# EasyEDA Pro project corialis_breakout.epro

# Schematic DB
Board Name: Board1; Create Date: 2026-05-29; Page Name: P1; Project Name: corialis_breakout; Schematic Name: DB; Update Date: 2026-05-30; Company: EasyEDA.com; Page Size: A4; Version: V1.0
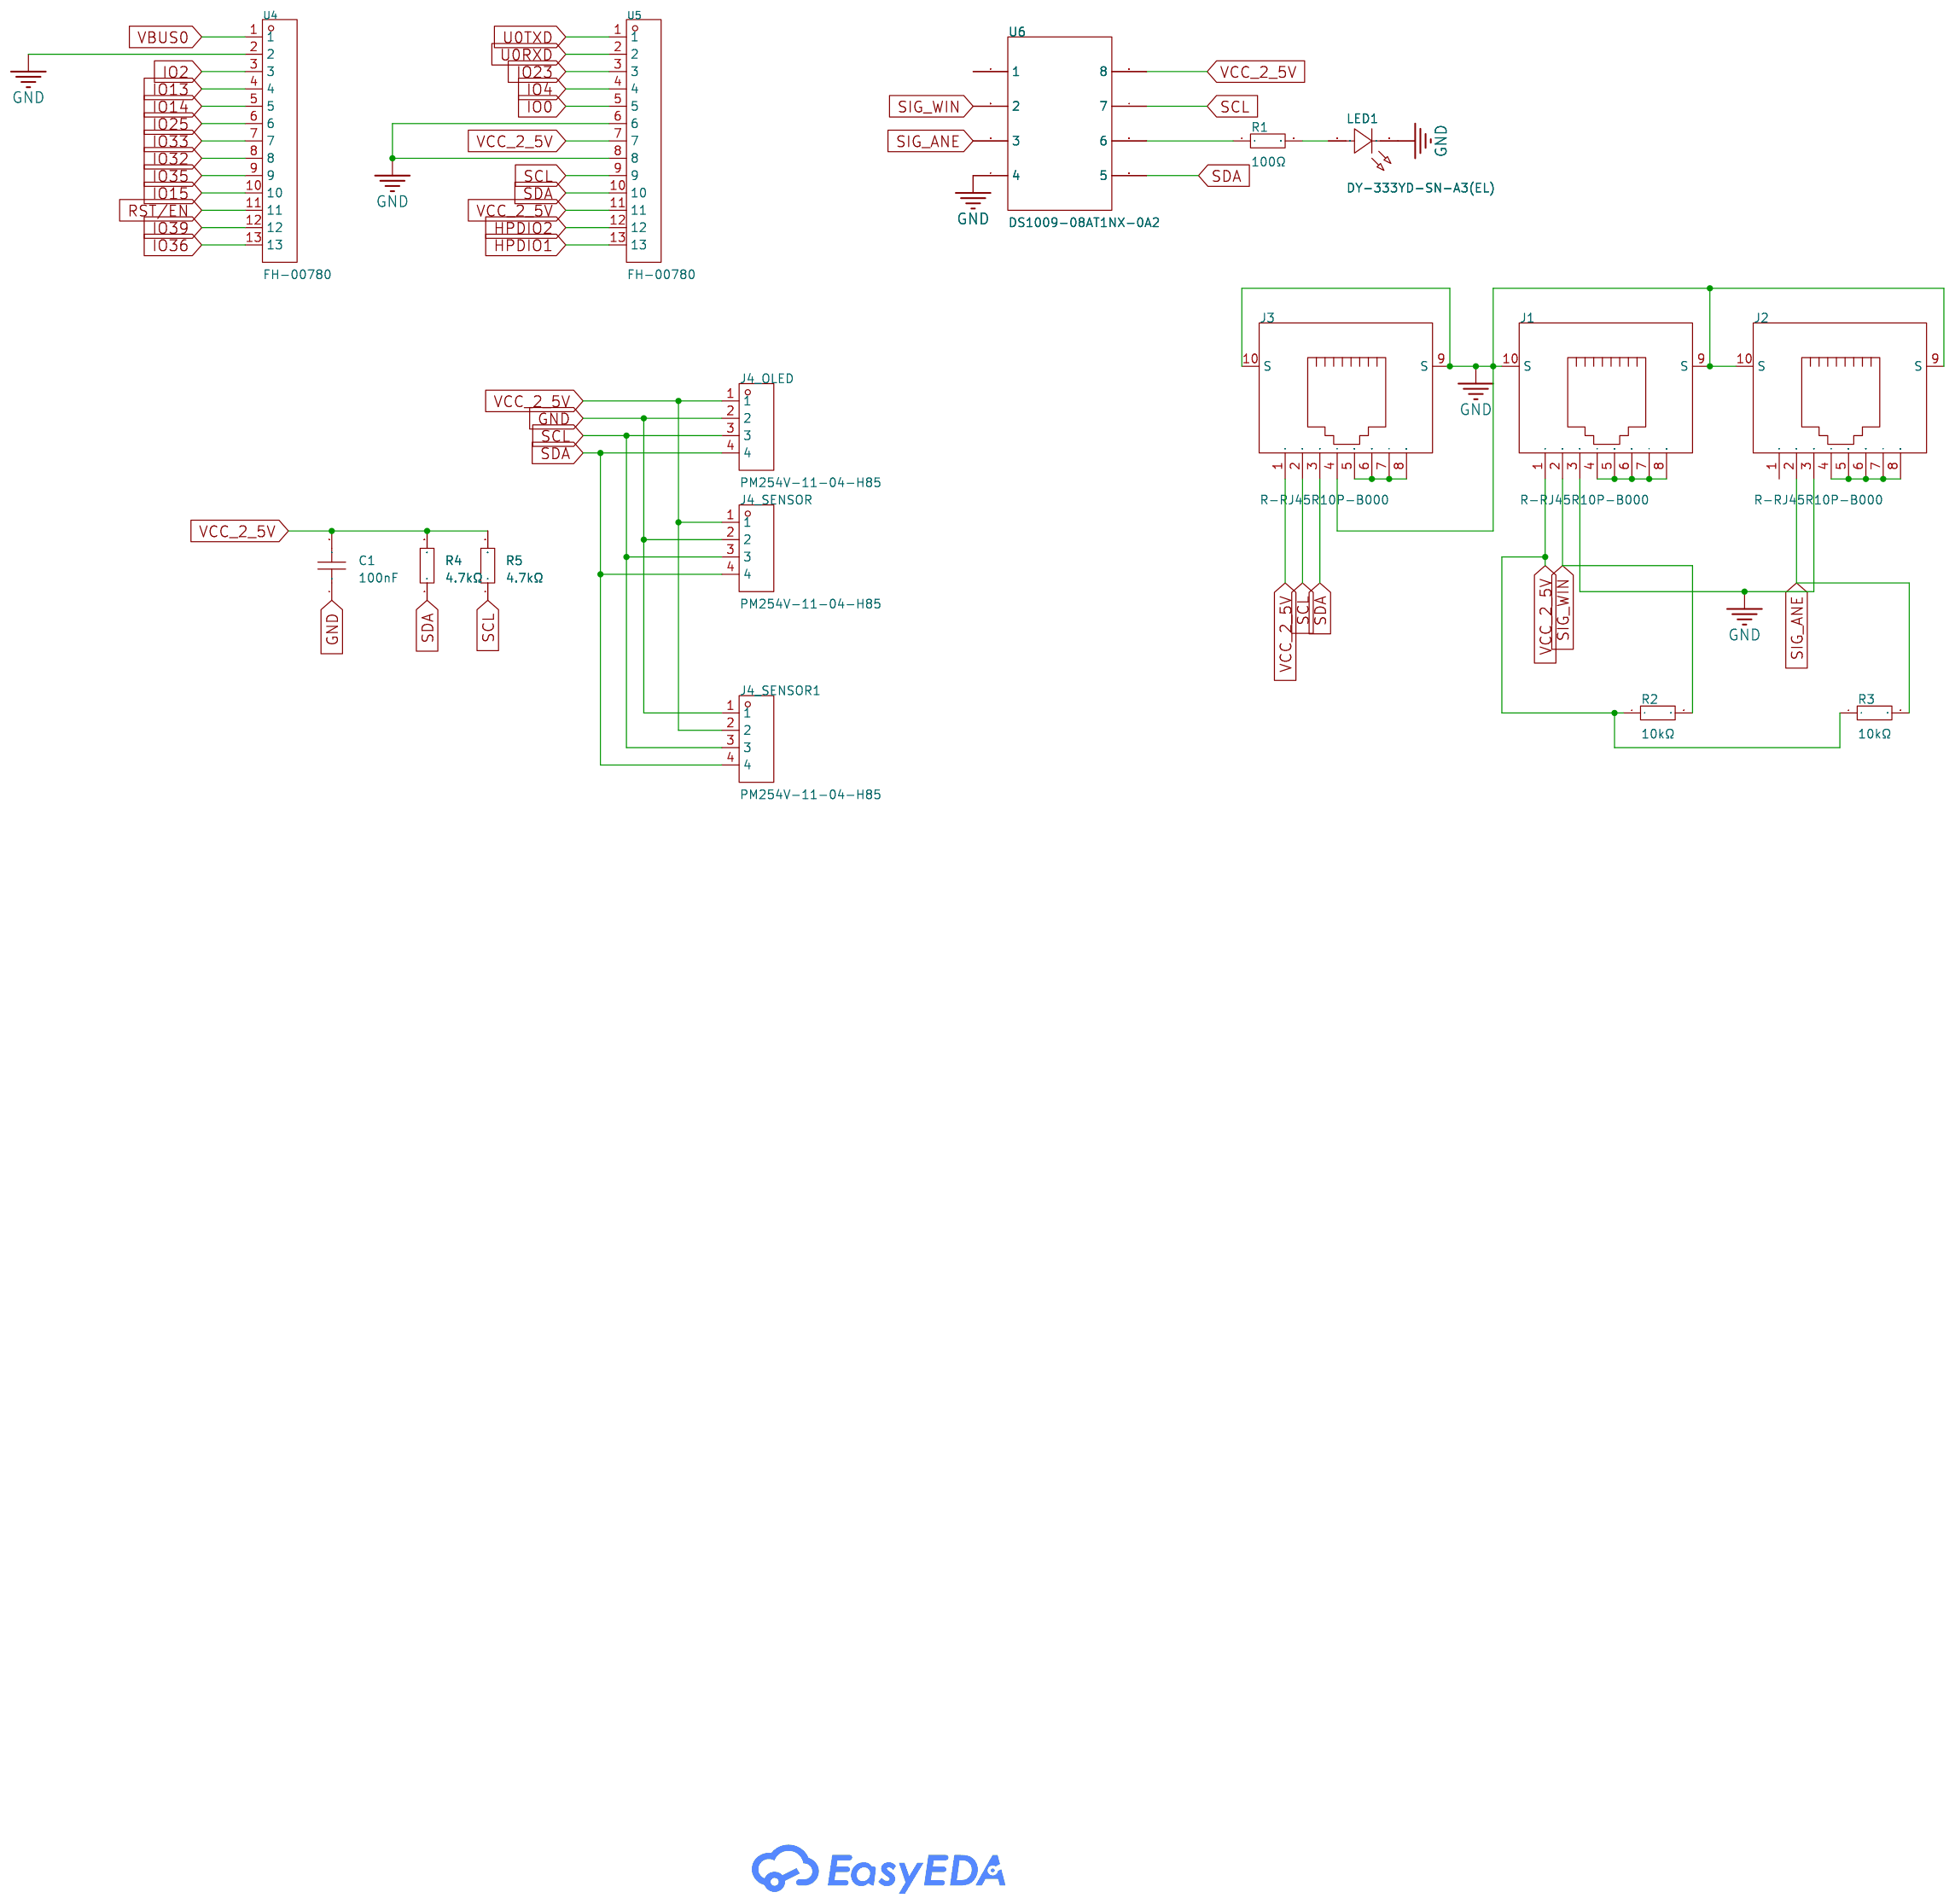
[diagram p0: schematic sheet]

## Parts
C1  100nF  [CAP-TH_L5.8-W2.4-P2.54-D0.6]
J1  R-RJ45R10P-B000  [RJ45-TH_R-RJ45R10P-B000]
J2  R-RJ45R10P-B000  [RJ45-TH_R-RJ45R10P-B000]
J3  R-RJ45R10P-B000  [RJ45-TH_R-RJ45R10P-B000]
J4_OLED  PM254V-11-04-H85  [HDR-TH_4P-P2.54-V-F]
J4_SENSOR  PM254V-11-04-H85  [HDR-TH_4P-P2.54-V-F]
J4_SENSOR1  PM254V-11-04-H85  [HDR-TH_4P-P2.54-V-F]
LED1  DY-333YD-SN-A3(EL)  [LED-TH_BD5.0-P2.54-FD-1]
R1  100Ω  [RES-TH_BD2.4-L6.3-P10.30-D0.6]
R2  10kΩ  [RES-TH_BD2.4-L6.3-P10.30-D0.6]
R3  10kΩ  [RES-TH_BD2.4-L6.3-P10.30-D0.6]
R4  4.7kΩ  [RES-TH_BD2.2-L6.5-P10.50-D0.6]
R5  4.7kΩ  [RES-TH_BD2.2-L6.5-P10.50-D0.6]
U4  FH-00780  [HDR-TH_13P-P2.54-V-F]
U5  FH-00780  [HDR-TH_13P-P2.54-V-F]
U6  DS1009-08AT1NX-0A2  [DIP-8_L10.2-W10.2-P2.54-LS7.6-BL]

## Library data of the parts
C1 = CC1H104ZA1ED3F5P1100: Capacitance:100nF Tolerance:-20%~+80% Tolerance:-20%~+80% Voltage Rating:50V Pin Spacing:2.54mm Temperature Coefficient:Y5V Diameter:5.8mm Body Thickness:2.4mm; LCSC Part Name: 100nF -20%~+80% 50V; Supplier Part: C2832506; Manufacturer: Dersonic(德尔创); Supplier Footprint: 插件,P=2.54mm; JLCPCB Part Class: Extended Part; Datasheet: https://item.szlcsc.com/datasheet/CC1H104ZA1ED3F5P1100/2990644.html; Supplier: LCSC; Tolerance: -20%~+80%; Voltage Rating: 50V; Pin Spacing: 2.54mm; Temperature Coefficient: Y5V; Diameter: 5.8mm; Body Thickness: 2.4mm; Check: true
J1-J3 = R-RJ45R10P-B000: Connector Type:RJ45 Jack Mounting Type:Right Angle Number of Ports:1 LED:Non-LED Shielding:Shielded Ratings:- Supplementary Features:Harpoon Contact (Plastic) Contact Material:Phosphor Bronze Contact Plating:Gold Operating Temperature:0℃~+70℃ Operating Te; LCSC Part Name: 弯插 不带LED; Supplier Part: C386758; Manufacturer: Ckmtw(灿科盟); Supplier Footprint: 弯插; JLCPCB Part Class: Extended Part; Datasheet: https://item.szlcsc.com/datasheet/R-RJ45R10P-B000/360865.html; Supplier: LCSC; Connector Type: RJ45 Jack; Mounting Type: Right Angle; Number of Ports: 1; LED: Non-LED; Shielding: Shielded; Supplementary Features: Harpoon Contact (Plastic); Contact Material: Phosphor Bronze; Contact Plating: Gold; Operating Temperature: 0℃~+70℃; Check: true
J4_OLED J4_SENSOR J4_SENSOR1 = PM254V-11-04-H85: Holes Structure:1x4P Pitch:2.54mm Row Spacing:- Circular Hole / Square Hole:Square Hole Mounting Type:Through Hole Number of Rows:1 Number of Positions:4P Current Rating:3A Holes Direction:Top Insulation Height:8.5mm Contact Material:Brass Contact Plating; LCSC Part Name: 1x4P 间距:2.54mm 直插; Supplier Part: C541851; Manufacturer: XFCN(兴飞); Supplier Footprint: 插件,P=2.54mm; JLCPCB Part Class: Extended Part; Datasheet: https://item.szlcsc.com/datasheet/PM254V-11-04-H85/562472.html; Supplier: LCSC; Holes Structure: 1x4P; Pitch: 2.54mm; Circular Hole / Square Hole: Square Hole; Mounting Type: Through Hole; Number of Rows: 1; Number of Positions: 4P; Current Rating: 3A; Holes Direction: Top; Insulation Height: 8.5mm; Contact Material: Brass; Operating Temperature: -40℃~+105℃; Check: true
LED1 = DY-333YD-SN-A3(EL): Lamp Holder Type:5mm round lamp head Illumination Color:Yellow Voltage - Forward(Vf):2.4V Voltage - Forward(Vf):2.4V Power(Watts):60mW Forward Current:20mA Wavelength - Dominant:592nm Wavelength - Dominant:592nm Peak Wavelength:584nm Diode Configuration:D; LCSC Part Name: 发光二极管; Supplier Part: C7470706; Manufacturer: TONYU(东裕); Supplier Footprint: D=5mm; JLCPCB Part Class: Extended Part; Datasheet: https://item.szlcsc.com/datasheet/DY-333YD-SN-A3(EL)/8521722.html; Supplier: LCSC; Lamp Holder Type: 5mm round lamp head; Illumination Color: Yellow; Voltage - Forward(Vf): 2.4V; Power(Watts): 60mW; Forward Current: 20mA; Wavelength - Dominant: 592nm; Peak Wavelength: 584nm; Diode Configuration: Discrete Diode; Lens Color: Frosted Yellow Lens; Luminous Intensity: 300mcd; Viewing Angle: 100°; Operating Temperature: -25℃~+80℃; Check: true
R1 = MFR50SJT-52-100R: Type:Metal Film Resistors Resistance: Tolerance:±5% Tolerance:±5% Power(Watts):500mW Operating Temperature:-55℃~+155℃ Operating Temperature:-55℃~+155℃; LCSC Part Name: 金属膜电阻 100Ω ±5% 500mW 铜脚，圆柱状直插; Supplier Part: C176622; Manufacturer: YAGEO(国巨); Supplier Footprint: 插件,D2.4xL6.3mm; JLCPCB Part Class: Extended Part; Datasheet: https://atta.szlcsc.com/upload/public/pdf/source/20191118/C457825_18355E864DE4965678DC27B0EBC3E21E.pdf; Supplier: LCSC; Type: Metal Film Resistors; Tolerance: ±5%; Power(Watts): 500mW; Operating Temperature: -55℃~+155℃; Check: true
R2 R3 = MFR50SJT-52-10K: Type:Metal Film Resistor Resistance:10kΩ Tolerance:±5% Tolerance:±5% Voltage-Supply(Max):- Power(Watts):500mW Operating Temperature:-55℃~+155℃ Operating Temperature:-55℃~+155℃; LCSC Part Name: 金属膜电阻 10kΩ ±5% 500mW 小体积，铜脚，圆柱状直插; Supplier Part: C176623; Manufacturer: YAGEO(国巨); Supplier Footprint: 插件,D2.4xL6.3mm; JLCPCB Part Class: Extended Part; Datasheet: https://item.szlcsc.com/datasheet/MFR50SJT-52-10K/188013.html; Supplier: LCSC; Type: Metal Film Resistor; Tolerance: ±5%; Power(Watts): 500mW; Operating Temperature: -55℃~+155℃; Check: true
R4 R5 = MFR50SJT-52-4K7: Type:Metal Film Resistors Resistance: Tolerance:±5% Tolerance:±5% Power(Watts):500mW Operating Temperature:-55℃~+155℃ Operating Temperature:-55℃~+155℃; LCSC Part Name: 金属膜电阻 4.7kΩ ±5% 500mW 小体积，铜脚，圆柱状直插; Supplier Part: C176641; Manufacturer: YAGEO(国巨); Supplier Footprint: 插件,D2.4xL6.3mm; JLCPCB Part Class: Extended Part; Datasheet: https://atta.szlcsc.com/upload/public/pdf/source/20191118/C457825_18355E864DE4965678DC27B0EBC3E21E.pdf; Supplier: LCSC; Type: Metal Film Resistors; Tolerance: ±5%; Power(Watts): 500mW; Operating Temperature: -55℃~+155℃; Check: true
U4 U5 = FH-00780: Holes Structure:1x13P Pitch:2.54mm Row Spacing:- Circular Hole / Square Hole:Square Holes Mounting Type:Straight Number of Rows:Plugin Number of Holes:13P Current Rating (Max):3A Voltage Rating (Max):- Holes Direction:Top Insulation Height:8.5mm Operating; LCSC Part Name: 间距:2.54mm 1x13P 直插; Supplier Part: C2685211; Manufacturer: Liansheng(连盛); Supplier Footprint: 插件,P=2.54mm; JLCPCB Part Class: Extended Part; Datasheet: https://atta.szlcsc.com/upload/public/pdf/source/20210126/C2685211_8FBC64DBE0F9C18E412CD3F3A5CDC87D.pdf; Supplier: LCSC; Holes Structure: 1x13P; Pitch: 2.54mm; Circular Hole / Square Hole: Square Holes; Mounting Type: Straight; Number of Rows: Plugin; Number of Holes: 13P; Current Rating (Max): 3A; Holes Direction: Top; Insulation Height: 8.5mm; Operating Temperature Range: -40℃~+105℃; Check: true
U6 = DS1009-08AT1NX-0A2: Adaptation Package Type:DIP Pitch:2.54mm Row Spacing:7.62mm Circular Holes/Square Holes:Square Hole Number of Positions:8P Contact Plating:Tin Operating Temperature:-20℃~+105℃ Operating Temperature:-20℃~+105℃; LCSC Part Name: 间距2.54mm 方孔 P数:8P; Supplier Part: C72124; Manufacturer: CONNFLY; Supplier Footprint: DIP-8; JLCPCB Part Class: Extended Part; Datasheet: https://item.szlcsc.com/datasheet/DS1009-08AT1NX-0A2/73233.html; Supplier: LCSC; Adaptation Package Type: DIP; Pitch: 2.54mm; Row Spacing: 7.62mm; Circular Holes/Square Holes: Square Hole; Number of Positions: 8P; Contact Plating: Tin; Operating Temperature: -20℃~+105℃; Check: true

## Nets
GND: C1.1 J1.3 J1.9(S) J1.10(S) J2.3 J2.9(S) J2.10(S) J3.4 J3.9(S) J3.10(S) J4_OLED.2 J4_SENSOR.2 J4_SENSOR1.1 LED1.1(K) U4.2 U5.6 U5.8 U6.4
VBUS0: U4.1
VCC_2_5V: C1.2 J1.1 J3.1 J4_OLED.1 J4_SENSOR.1 J4_SENSOR1.2 R2.1 R3.1 R4.2 R5.2 U5.7 U5.11 U6.8
HPDIO1: U5.13
HPDIO2: U5.12
IO0: U5.5
IO2: U4.3
IO4: U5.4
IO13: U4.4
IO14: U4.5
IO15: U4.10
IO23: U5.3
IO25: U4.6
IO32: U4.8
IO33: U4.7
IO35: U4.9
IO36: U4.13
IO39: U4.12
RST/EN: U4.11
SCL: J3.2 J4_OLED.3 J4_SENSOR.3 J4_SENSOR1.3 R5.1 U5.9 U6.7
SDA: J3.3 J4_OLED.4 J4_SENSOR.4 J4_SENSOR1.4 R4.1 U5.10 U6.5
SIG_ANE: J2.2 R3.2 U6.3
SIG_WIN: J1.2 R2.2 U6.2
U0RXD: U5.2
U0TXD: U5.1
$1N16523: R1.1 U6.6
$1N16615: LED1.2(A) R1.2
$1N17501: J2.4 J2.5 J2.6 J2.7 J2.8
$1N17509: J1.4 J1.5 J1.6 J1.7 J1.8
$1N17517: J3.5 J3.6 J3.7 J3.8

Not connected (* = marked no-connect by the designer): J2 1; U6 1

# Board DB_PCS
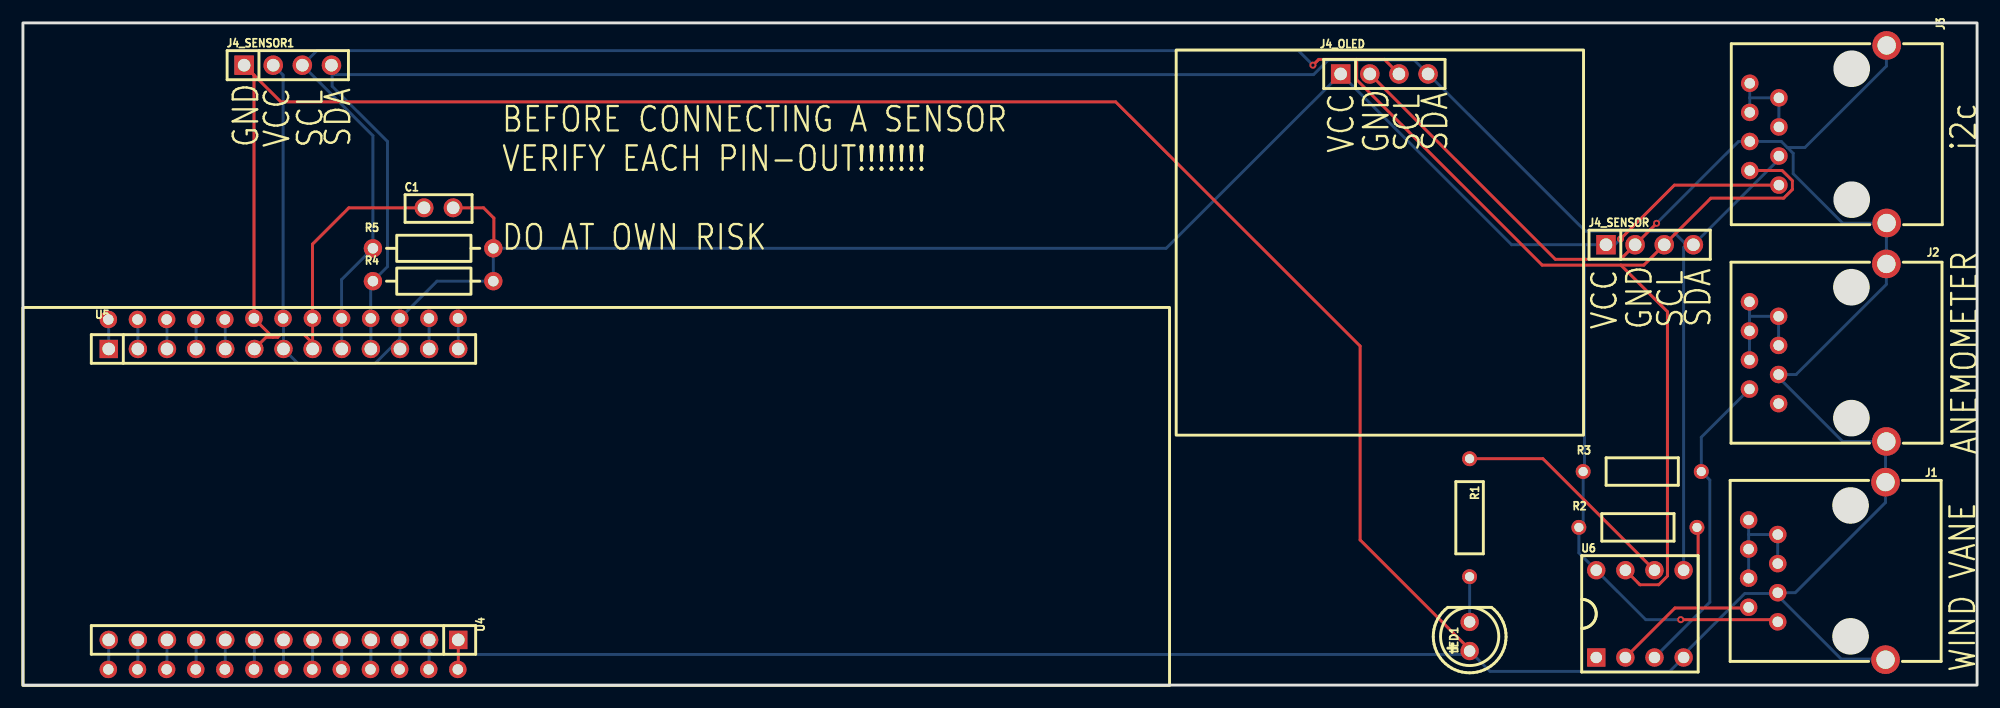
[diagram p1: board, top side]
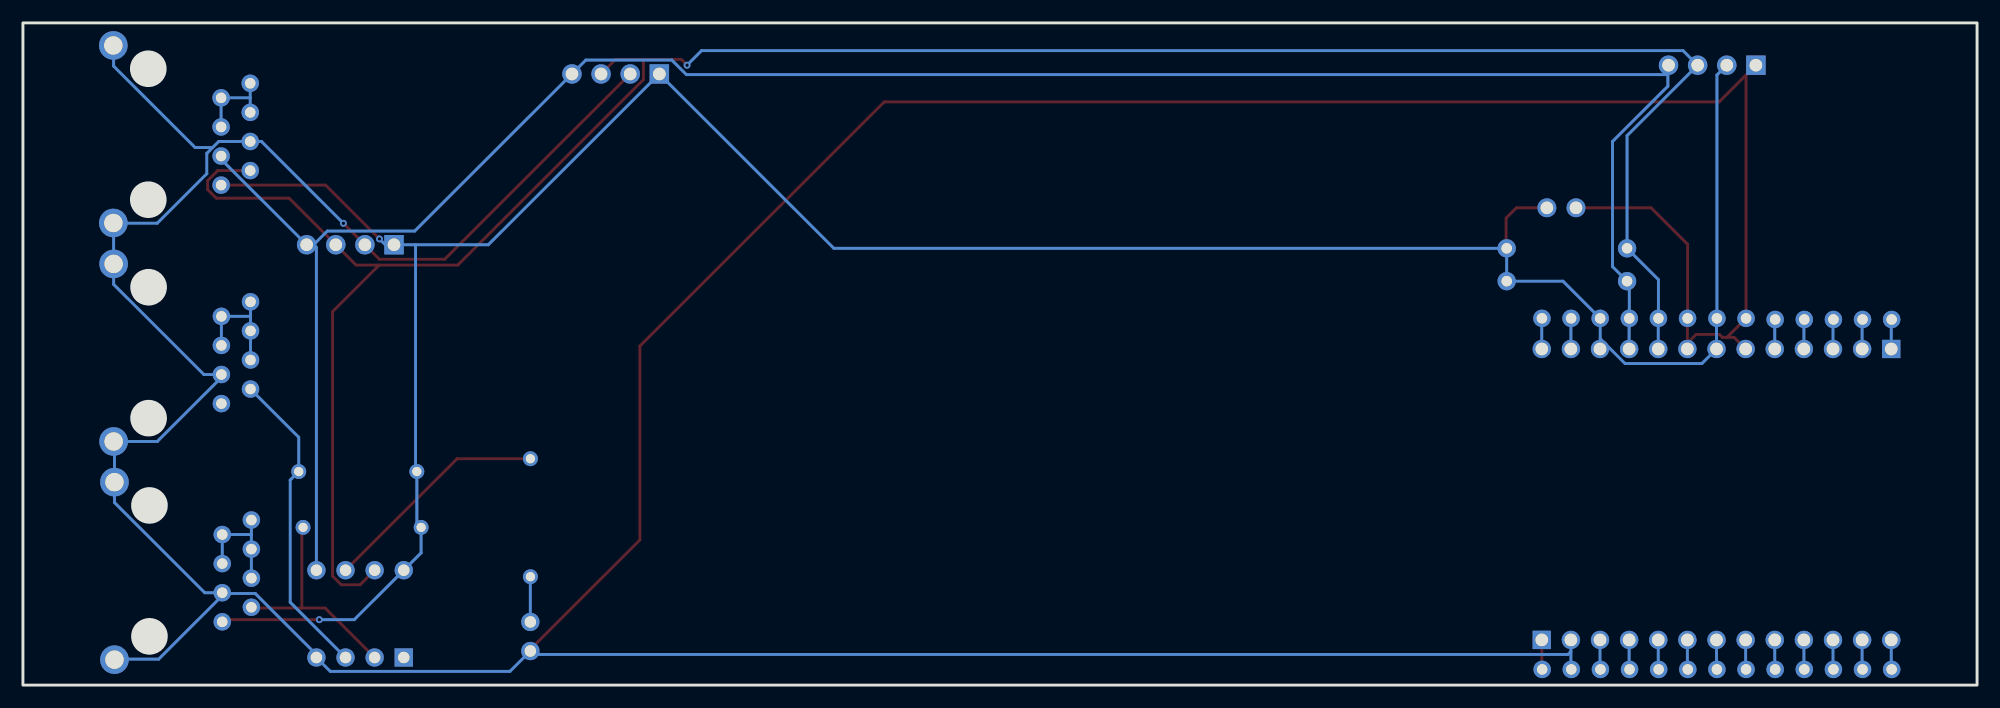
[diagram p2: board, bottom side, seen from below]

Outline 170.43 x 57.81 mm; copper layers: Top Layer, Bottom Layer. Coordinates in mm from the lower left corner of the outline.
Outline path: rectangle 0,57.81 170.43,0
Stack: Top Layer 0.035mm / Dielectric1 1.51mm FR4 er 4.5 / Bottom Layer 0.035mm

## Design rules (mm)
template: JLCPCB Capability(Two Layers Board)
spacing copperThickness1oz (default): track to track 0.102, other pairs 0.152 to 0.3
spacing copperThickness2oz: track to track 0.203, other pairs 0.152 to 0.3
track width copperThickness1oz (default): min 0.127, default 0.254, max 2.54
track width copperThickness2oz: min 0.203, default 0.254, max 2.54
differential pair differentialPair (default): width min 0.127, default 0.254, max 2.54; gap min 0.152, default 0.152
via viaSize (default): diameter min 0.5, default 0.61, max 10; hole min 0.3, default 0.305, max 6.3

## Placement (name value [footprint] x y rotation side)
C1  100nF  [CAP-TH_L5.8-W2.4-P2.54-D0.6]  36.25 41.67 0 top
J1  R-RJ45R10P-B000  [RJ45-TH_R-RJ45R10P-B000]  156.47 9.97 270 top
J2  R-RJ45R10P-B000  [RJ45-TH_R-RJ45R10P-B000]  156.55 29.02 270 top
J3  R-RJ45R10P-B000  [RJ45-TH_R-RJ45R10P-B000]  156.57 48.09 270 top
J4_OLED  PM254V-11-04-H85  [HDR-TH_4P-P2.54-V-F]  118.74 53.35 0 top
J4_SENSOR  PM254V-11-04-H85  [HDR-TH_4P-P2.54-V-F]  141.87 38.44 0 top
J4_SENSOR1  PM254V-11-04-H85  [HDR-TH_4P-P2.54-V-F]  23.1 54.12 0 top
LED1  DY-333YD-SN-A3(EL)  [LED-TH_BD5.0-P2.54-FD-1]  126.17 4.24 90 top
NOREF  -  [Pad_e2694]  20.15 32.02 0 top
NOREF#2  -  [Pad_e2677]  9.99 1.37 0 top
NOREF#3  -  [Pad_e2684]  27.77 1.37 0 top
NOREF#4  -  [Pad_e2691]  12.53 31.92 0 top
NOREF#5  -  [Pad_e2701]  35.41 32.02 0 top
NOREF#6  -  [Pad_e2695]  22.69 32.02 0 top
NOREF#7  -  [Pad_e2699]  30.33 32.02 0 top
NOREF#8  -  [Pad_e2700]  32.87 32.02 0 top
NOREF#9  -  [Pad_e2682]  22.69 1.37 0 top
NOREF#10  -  [Pad_e2689]  7.45 31.92 0 top
NOREF#11  -  [Pad_e2696]  25.25 32.02 0 top
NOREF#12  -  [Pad_e2685]  30.31 1.37 0 top
NOREF#13  -  [Pad_e2687]  35.39 1.37 0 top
NOREF#14  -  [Pad_e2683]  25.23 1.37 0 top
NOREF#15  -  [Pad_e2680]  17.61 1.37 0 top
NOREF#16  -  [Pad_e2698]  27.79 32.02 0 top
NOREF#17  -  [Pad_e2702]  37.95 32.02 0 top
NOREF#18  -  [Pad_e2678]  12.53 1.37 0 top
NOREF#19  -  [Pad_e2690]  9.99 31.92 0 top
NOREF#20  -  [Pad_e2688]  37.93 1.37 0 top
NOREF#21  -  [Pad_e2679]  15.07 1.37 0 top
NOREF#22  -  [Pad_e2676]  7.45 1.37 0 top
NOREF#23  -  [Pad_e2686]  32.85 1.37 0 top
NOREF#24  -  [Pad_e2692]  15.07 31.92 0 top
NOREF#25  -  [Pad_e2681]  20.15 1.37 0 top
NOREF#26  -  [Pad_e2693]  17.61 31.92 0 top
R1  100Ω  [RES-TH_BD2.4-L6.3-P10.30-D0.6]  126.17 14.61 270 top
R2  10kΩ  [RES-TH_BD2.4-L6.3-P10.30-D0.6]  140.85 13.77 0 top
R3  10kΩ  [RES-TH_BD2.4-L6.3-P10.30-D0.6]  141.22 18.64 0 top
R4  4.7kΩ  [RES-TH_BD2.2-L6.5-P10.50-D0.6]  35.77 35.26 0 top
R5  4.7kΩ  [RES-TH_BD2.2-L6.5-P10.50-D0.6]  35.77 38.13 0 top
U4  FH-00780  [HDR-TH_13P-P2.54-V-F]  22.72 3.94 180 top
U5  FH-00780  [HDR-TH_13P-P2.54-V-F]  22.72 29.34 0 top
U6  DS1009-08AT1NX-0A2  [DIP-8_L10.2-W10.2-P2.54-LS7.6-BL]  141.02 6.22 0 top

## Footprints (pads in the part's own frame, mm; a bottom-side part is the same pattern mirrored in y, then rotated)
CAP-TH_L5.8-W2.4-P2.54-D0.6
  round 1.65 hole 1.1: 1(-1.27,0) 2(1.27,0)
DIP-8_L10.2-W10.2-P2.54-LS7.6-BL
  rect 1.6x1.6 hole 1: 1(-3.808,-3.81)
  round 1.6 hole 1: 2(-1.27,-3.81) 3(1.27,-3.81) 4(3.81,-3.81) 5(3.81,3.81) 6(1.27,3.81) 7(-1.27,3.81) 8(-3.81,3.81)
HDR-TH_4P-P2.54-V-F
  rect 1.7x1.7 hole 1.1: 1(-3.81,0)
  round 1.7 hole 1.1: 2(-1.27,0) 3(1.27,0) 4(3.81,0)
HDR-TH_13P-P2.54-V-F
  rect 1.6x1.6 hole 1.1: 1(-15.24,0)
  round 1.6 hole 1.1: 2(-12.7,0) 3(-10.16,0) 4(-7.62,0) 5(-5.08,0) 6(-2.54,0) 7(0,0) 8(2.54,0) 9(5.08,0) 10(7.62,0) 11(10.16,0) 12(12.7,0) 13(15.24,0)
LED-TH_BD5.0-P2.54-FD-1
  round 1.6 hole 1: 1(-1.27,0) 2(1.27,0)
Pad_e2676
  round 1.524 hole 0.914: 1(0,0)
Pad_e2677
  round 1.524 hole 0.914: 2(0,0)
Pad_e2678
  round 1.524 hole 0.914: 3(0,0)
Pad_e2679
  round 1.524 hole 0.914: 4(0,0)
Pad_e2680
  round 1.524 hole 0.914: 5(0,0)
Pad_e2681
  round 1.524 hole 0.914: 6(0,0)
Pad_e2682
  round 1.524 hole 0.914: 7(0,0)
Pad_e2683
  round 1.524 hole 0.914: 8(0,0)
Pad_e2684
  round 1.524 hole 0.914: 9(0,0)
Pad_e2685
  round 1.524 hole 0.914: 10(0,0)
Pad_e2686
  round 1.524 hole 0.914: 11(0,0)
Pad_e2687
  round 1.524 hole 0.914: 12(0,0)
Pad_e2688
  round 1.524 hole 0.914: 13(0,0)
Pad_e2689
  round 1.524 hole 0.914: 14(0,0)
Pad_e2690
  round 1.524 hole 0.914: 15(0,0)
Pad_e2691
  round 1.524 hole 0.914: 16(0,0)
Pad_e2692
  round 1.524 hole 0.914: 17(0,0)
Pad_e2693
  round 1.524 hole 0.914: 18(0,0)
Pad_e2694
  round 1.524 hole 0.914: 19(0,0)
Pad_e2695
  round 1.524 hole 0.914: 20(0,0)
Pad_e2696
  round 1.524 hole 0.914: 21(0,0)
Pad_e2698
  round 1.524 hole 0.914: 22(0,0)
Pad_e2699
  round 1.524 hole 0.914: 23(0,0)
Pad_e2700
  round 1.524 hole 0.914: 24(0,0)
Pad_e2701
  round 1.524 hole 0.914: 25(0,0)
Pad_e2702
  round 1.524 hole 0.914: 26(0,0)
RES-TH_BD2.2-L6.5-P10.50-D0.6
  round 1.6 hole 0.914: 1(-5.25,0) 2(5.25,0)
RES-TH_BD2.4-L6.3-P10.30-D0.6
  round 1.3 hole 0.8: 1(-5.15,0) 2(5.15,0)
RJ45-TH_R-RJ45R10P-B000
  round 1.524 hole 0.914: 1(4.445,-3.43) 2(3.175,-5.97) 3(1.905,-3.43) 4(0.635,-5.97) 5(-0.635,-3.43) 6(-1.905,-5.97) 7(-3.175,-3.43) 8(-4.445,-5.97)
  round 2.5 hole 1.6: 9(7.75,5.97) 10(-7.75,5.97)

## Nets
GND: C1.1 J1.3 J1.9 J1.10 J2.3 J2.9 J2.10 J3.4 J3.9 J3.10 J4_OLED.2 J4_SENSOR.2 J4_SENSOR1.1 LED1.1 NOREF.19 NOREF#11.21 NOREF#13.12 U4.2 U5.6 U5.8 U6.4
VBUS0: NOREF#20.13 U4.1
VCC_2_5V: C1.2 J1.1 J3.1 J4_OLED.1 J4_SENSOR.1 J4_SENSOR1.2 NOREF#6.20 NOREF#8.24 R2.1 R3.1 R4.2 R5.2 U5.7 U5.11 U6.8
HPDIO1: NOREF#17.26 U5.13
HPDIO2: NOREF#5.25 U5.12
IO0: NOREF#26.18 U5.5
IO2: NOREF#23.11 U4.3
IO4: NOREF#24.17 U5.4
IO13: NOREF#12.10 U4.4
IO14: NOREF#3.9 U4.5
IO15: NOREF#21.4 U4.10
IO23: NOREF#4.16 U5.3
IO25: NOREF#14.8 U4.6
IO32: NOREF#25.6 U4.8
IO33: NOREF#9.7 U4.7
IO35: NOREF#15.5 U4.9
IO36: NOREF#22.1 U4.13
IO39: NOREF#2.2 U4.12
RST/EN: NOREF#18.3 U4.11
SCL: J3.2 J4_OLED.3 J4_SENSOR.3 J4_SENSOR1.3 NOREF#16.22 R5.1 U5.9 U6.7
SDA: J3.3 J4_OLED.4 J4_SENSOR.4 J4_SENSOR1.4 NOREF#7.23 R4.1 U5.10 U6.5
SIG_ANE: J2.2 R3.2 U6.3
SIG_WIN: J1.2 R2.2 U6.2
U0RXD: NOREF#19.15 U5.2
U0TXD: NOREF#10.14 U5.1
$1N16523: R1.1 U6.6
$1N16615: LED1.2 R1.2
$1N17501: J2.4 J2.5 J2.6 J2.7 J2.8
$1N17509: J1.4 J1.5 J1.6 J1.7 J1.8
$1N17517: J3.5 J3.6 J3.7 J3.8

Pads without a net: J2 1; U6 1

## Via types
v1: diameter 0.61, hole 0.305, Top Layer to Bottom Layer, 4 vias

## Routing (per net, layer and track width the routed paths; a pad name or vN(x,y) marks a point on that pad's centre or on a via; arc(x,y) is an arc through that point)
GND: length 445.3
  Top Layer w0.254: 21.8,30.36 21.2,30.36 U5.6 ; 21.8,30.36 NOREF.19 20.15,53.26 ; 21.8,30.36 22.22,30.36 22.47,30.61 24.5,30.61 25.26,29.85 ; U5.8 25.26,29.85 ; 25.26,29.85 25.26,32 NOREF#11.21 25.25,38.49 28.42,41.67 34.98,41.67 ; 20.15,53.26 J4_SENSOR1.1 ; 20.15,53.26 22.49,50.92 95.3,50.92 116.62,29.59 116.62,12.67 126.17,3.12 LED1.1 ; J4_OLED.2 133.65,37.17 139.33,37.17 J4_SENSOR.2 v1(142.48,40.32)
  Bottom Layer w0.254: NOREF#13.12 35.42,1.4 35.42,2.93 ; J1.3 153.04,7.81 158.59,2.26 162.4,2.26 J1.9 ; J1.3 152.98,8 150.17,8 144.83,2.66 U6.4 143.62,1.2 127.95,1.2 LED1.1 125.87,2.67 35.68,2.67 35.42,2.93 ; J1.3 154.57,8.06 162.44,15.94 162.44,17.72 ; 153.88,46.93 154.39,46.42 154.39,44.64 158.71,40.32 162.52,40.32 ; 153.88,46.93 153.35,47.46 J3.4 149.62,47.46 v1(142.48,40.32) ; 153.88,46.93 155.41,46.93 162.52,54.04 162.52,55.82 J3.10 ; 162.52,40.32 J2.10 162.52,34.99 154.64,27.11 J2.3 153.12,26.86 158.71,21.27 J2.9 162.44,21.19 J1.10 ; 162.52,40.32 J3.9 ; 35.42,2.93 U4.2
VBUS0: length 2.6
  Top Layer w0.254: U4.1 37.96,1.4 NOREF#20.13
VCC_2_5V: length 231.8
  Top Layer w0.254: 153.14,43.65 144.03,43.65 v1(139.33,38.95) ; C1.2 40.17,41.67 41.07,40.77 41.07,38.18 R5.2 ; v1(144.58,5.71) 152.86,5.71 J1.1
  Bottom Layer w0.254: 136.19,38.44 129.84,38.44 J4_OLED.1 99.7,38.13 R5.2 R4.2 36.11,35.26 NOREF#8.24 32.87,30.24 32.48,29.85 ; 136.19,38.44 136.19,18.76 R3.1 136.07,14.14 R2.1 135.7,11.54 141.53,5.71 v1(144.58,5.71) ; 136.19,38.44 J4_SENSOR.1 138.83,38.44 v1(139.33,38.95) ; 32.48,29.85 30.7,28.07 23.99,28.07 U5.7 22.72,31.98 NOREF#6.20 22.69,53.26 J4_SENSOR1.2 ; 32.48,29.85 32.48,29.75 U5.11
HPDIO1: length 2.7
  Bottom Layer w0.254: NOREF#17.26 37.96,32 U5.13
HPDIO2: length 2.7
  Bottom Layer w0.254: U5.12 35.42,32 NOREF#5.25
IO0: length 2.6
  Bottom Layer w0.254: U5.5 17.64,31.88 NOREF#26.18
IO2: length 2.6
  Bottom Layer w0.254: U4.3 32.88,1.4 NOREF#23.11
IO4: length 2.6
  Bottom Layer w0.254: U5.4 15.1,31.88 NOREF#24.17
IO13: length 2.6
  Bottom Layer w0.254: U4.4 30.34,1.4 NOREF#12.10
IO14: length 2.6
  Bottom Layer w0.254: U4.5 27.8,1.4 NOREF#3.9
IO15: length 2.6
  Bottom Layer w0.254: U4.10 15.1,1.4 NOREF#21.4
IO23: length 2.6
  Bottom Layer w0.254: U5.3 12.56,31.88 NOREF#4.16
IO25: length 2.6
  Bottom Layer w0.254: U4.6 25.26,1.4 NOREF#14.8
IO32: length 2.6
  Bottom Layer w0.254: NOREF#25.6 20.18,1.4 U4.8
IO33: length 2.6
  Bottom Layer w0.254: NOREF#9.7 22.72,1.4 U4.7
IO35: length 2.6
  Bottom Layer w0.254: NOREF#15.5 17.64,1.4 U4.9
IO36: length 2.6
  Bottom Layer w0.254: NOREF#22.1 7.48,1.4 U4.13
IO39: length 2.6
  Bottom Layer w0.254: NOREF#2.2 10.02,1.4 U4.12
RST/EN: length 2.6
  Bottom Layer w0.254: U4.11 12.56,1.4 NOREF#18.3
SCL: length 213.3
  Top Layer w0.254: 139.36,36.67 143.42,32.6 143.42,9.52 142.66,8.76 141.02,8.76 139.75,10.03 ; 139.36,36.67 141.37,36.67 J4_SENSOR.3 147.21,42.51 153.56,42.51 154.32,43.27 154.32,44.03 153.43,44.92 J3.2 ; 139.36,36.67 132.5,36.67 116.32,52.85 116.32,54.63 ; 116.32,54.63 118.73,54.63 J4_OLED.3 ; 116.32,54.63 113.02,54.63 v1(112.51,54.12)
  Bottom Layer w0.254: U5.9 27.8,32 NOREF#16.22 27.79,35.4 R5.1 30.52,47.96 J4_SENSOR1.3 25.64,55.39 111.24,55.39 v1(112.51,54.12)
SDA: length 192.7
  Bottom Layer w0.254: 145.08,38.44 143.88,39.64 136.26,39.64 J4_OLED.4 121.33,54.57 113.84,54.57 112.57,53.3 26.97,53.3 ; 145.08,38.44 J4_SENSOR.4 153.14,45.9 J3.3 ; 145.08,38.44 144.83,38.2 144.83,10.03 ; 26.97,53.3 26.97,52.28 31.79,47.46 31.79,36.53 R4.1 30.33,35.07 NOREF#7.23 30.34,32 U5.10 ; 26.97,53.3 26.97,54.06 J4_SENSOR1.4
SIG_ANE: length 27.5
  Bottom Layer w0.254: J2.2 146.37,21.64 R3.2 147.12,17.9 147.12,7.23 U6.3
SIG_WIN: length 19.7
  Top Layer w0.254: 146.1,6.73 144.07,6.73 U6.2 ; 146.1,6.73 146.1,13.66 R2.2 ; 146.1,6.73 150.44,6.73 J1.2
U0RXD: length 2.6
  Bottom Layer w0.254: U5.2 10.02,31.88 NOREF#19.15
U0TXD: length 2.6
  Bottom Layer w0.254: NOREF#10.14 7.48,31.88 U5.1
$1N16523: length 20.2
  Top Layer w0.254: 142.29,10.03 132.56,19.76 R1.1
$1N16615: length 3.9
  Bottom Layer w0.254: LED1.2 126.17,9.46
$1N17501: length 10.2
  Bottom Layer w0.254: J2.5 J2.7 150.58,32.19 ; 150.58,32.19 J2.6 J2.4 ; 150.58,32.19 J2.8
$1N17509: length 10.2
  Bottom Layer w0.254: J1.4 J1.6 150.5,13.14 ; 150.5,13.14 J1.8 ; 150.5,13.14 J1.7 J1.5
$1N17517: length 7.6
  Bottom Layer w0.254: 150.6,51.27 J3.6 ; 150.6,51.27 J3.7 153.14,48.73 ; 150.6,51.27 J3.8

## Text on the board
Top Silkscreen Layer: BEFORE CONNECTING A SENSOR / VERIFY EACH PIN-OUT!!!!!!! / DO AT OWN RISK | GND | VCC | SCL | SDA | WIND VANE | i2c | ANEMOMETER
